# Altium schematic sheet indicator.SchDoc
size Letter; SheetNumber: 8; SheetTotal: 8
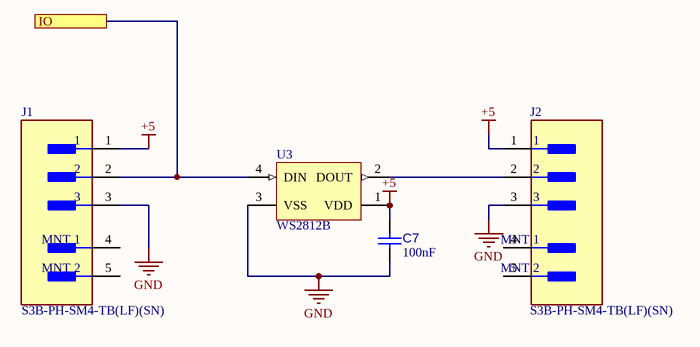
[diagram p0: indicator.SchDoc]

## Parts
C7  value 100nF  [3]  (hidden comment: Capacitor 100 nF 10 % 50V 0603)
J1  S3B-PH-SM4-TB(LF)(SN)  [FP-S3B-PH-SM4-TB_LF_SN-MFG]
J2  S3B-PH-SM4-TB(LF)(SN)  [FP-S3B-PH-SM4-TB_LF_SN-MFG]
U3  WS2812B  [ADAI-WS2812B_V]

## Ports
IO

## Nets
+5: C7.2 J1.1 J2.1 U3.1(VDD)
GND: C7.1 J1.3 J2.3 U3.3(VSS)
IO: J1.2 U3.4(DIN) ; port IO
NetJ2_2: J2.2 U3.2(DOUT)

Not connected (* = marked no-connect by the designer): J1 4(MNT_1) 5(MNT_2); J2 4(MNT_1) 5(MNT_2)

## Library data of the parts
C7 = CMP-001-00092-5: CAP CER 100 nF 50V X7R 0603; Capacitor Type: Ceramic; Tolerance: 10%; Voltage Rating: 50V; Case/Package: 0603; LCSC Part Number: C14663
J1 J2 = CMP-2000-07023-2: CONN HEADER SMD R/A 3POS 2MM; Voltage Rating: 100V; Gender: Male; Max Current Rating: 2A; Number of Contacts: 3; Insulation Resistance: 1GR; Contact Resistance: 10mR; Termination: Solder; Orientation: Right Angle; Insulation Color: Natural; Flammability Rating: UL94 V-0; Width: 5mm; Lead Free: Lead Free; Mount: Surface Mount; Max Operating Temperature: 85°C; Connector Type: Header; Fastening Type: Detent; Max Voltage Rating (DC): 100V; Housing Material: Polyamide; Number of Rows: 1; Housing Color: Beige; Contact Plating: Tin; Contact Shape: Square; Working Voltage: 100V; Contact Material: Copper Alloy; Contact Mating Length: 0.13inch; Contact Type: Male Pin; Max Voltage Rating (AC): 100V; Packaging: Tape and Reel; Min Operating Temperature: -25°C; Number of Positions: 3; REACH SVHC: No SVHC; Contact Finish - Mating: TIN; Color: Natural; Length: 9.9mm; Insulation Material: Nylon; Depth: 7.6mm; Current Rating: 2A; Material: Polyamide; Voltage Rating (AC): 100V; Pitch: 2mm; Series: PH; Height: 9.4mm; Number of Poles: 3; Lead Pitch: 2mm
U3 = CMP-007-00035-2: Intelligent Control LED Integrated Light Source, 3.5 to 5.3 V, -25 to 80 degC, 4-Pin SMD, RoHS, Bulk; Manufacturer: Adafruit Industries; Datasheet URL: https://cdn-shop.adafruit.com/datasheets/WS2812B.pdf; Manufacturer URL: https://www.adafruit.com/; Datasheet Version: May-13; Case/Package: WS2812B; Mounting Technology: SM; RoHS Compliant: False; Package Description: 4-Pin Surface Mount Device, Body 5 x 5 mm, Pitch 3.3 mm; Package Reference: WS2812B